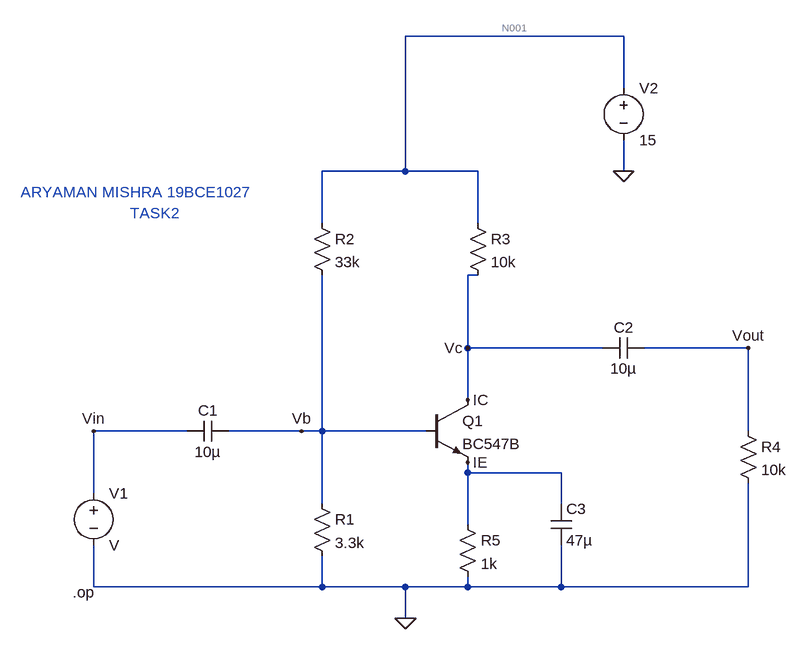
[diagram p0: schematic Draft1.asc]
Draft1.asc, the LTspice schematic file:
Version 4
SHEET 1 880 680
WIRE 128 -1088 -208 -1088
WIRE 128 -1008 128 -1088
WIRE -208 -880 -208 -1088
WIRE -208 -880 -336 -880
WIRE -96 -880 -208 -880
WIRE 128 -880 128 -928
WIRE -336 -800 -336 -880
WIRE -96 -800 -96 -880
WIRE -96 -720 -112 -720
WIRE -112 -608 -112 -720
WIRE 96 -608 -112 -608
WIRE 320 -608 160 -608
WIRE -112 -528 -112 -608
WIRE -544 -480 -688 -480
WIRE -368 -480 -480 -480
WIRE -336 -480 -336 -720
WIRE -336 -480 -368 -480
WIRE -176 -480 -336 -480
WIRE 320 -480 320 -608
WIRE -112 -416 -112 -432
WIRE 32 -416 -112 -416
WIRE -688 -384 -688 -480
WIRE -336 -368 -336 -480
WIRE 32 -368 32 -416
WIRE -112 -336 -112 -416
WIRE -688 -240 -688 -304
WIRE -336 -240 -336 -288
WIRE -336 -240 -688 -240
WIRE -208 -240 -336 -240
WIRE -112 -240 -112 -256
WIRE -112 -240 -208 -240
WIRE 32 -240 32 -304
WIRE 32 -240 -112 -240
WIRE 320 -240 320 -400
WIRE 320 -240 32 -240
WIRE -208 -192 -208 -240
FLAG -688 -480 Vin
FLAG -368 -480 Vb
FLAG 128 -880 0
FLAG 320 -608 Vout
FLAG -112 -608 Vc
FLAG -112 -528 IC
FLAG -112 -432 IE
FLAG -208 -192 0
DATAFLAG 528 -560 "V(ic)"
DATAFLAG 576 -512 "Ic(Q1)"
SYMBOL voltage -688 -400 R0
WINDOW 123 0 0 Left 0
WINDOW 39 0 0 Left 0
SYMATTR InstName V1
SYMBOL cap -480 -496 R90
WINDOW 0 0 32 VBottom 2
WINDOW 3 32 32 VTop 2
SYMATTR InstName C1
SYMATTR Value 10µ
SYMBOL res -352 -384 R0
SYMATTR InstName R1
SYMATTR Value 3.3k
SYMBOL res -352 -816 R0
SYMATTR InstName R2
SYMATTR Value 33k
SYMBOL res -112 -816 R0
SYMATTR InstName R3
SYMATTR Value 10k
SYMBOL npn -176 -528 R0
SYMATTR InstName Q1
SYMATTR Value BC547B
SYMBOL voltage 128 -1024 R0
WINDOW 123 0 0 Left 0
WINDOW 39 0 0 Left 0
SYMATTR InstName V2
SYMATTR Value 15
SYMBOL cap 160 -624 R90
WINDOW 0 0 32 VBottom 2
WINDOW 3 32 32 VTop 2
SYMATTR InstName C2
SYMATTR Value 10µ
SYMBOL res 304 -496 R0
SYMATTR InstName R4
SYMATTR Value 10k
SYMBOL res -128 -352 R0
SYMATTR InstName R5
SYMATTR Value 1k
SYMBOL cap 16 -368 R0
SYMATTR InstName C3
SYMATTR Value 47µ
TEXT -720 -232 Left 2 !.op
TEXT -800 -848 Left 2 ;ARYAMAN MISHRA 19BCE1027
TEXT -632 -816 Left 2 ;TASK2

The netlist it stands for:
* Draft1.asc
V1 Vin 0 V
C1 Vb Vin 10µ
R1 Vb 0 3.3k
R2 N001 Vb 33k
R3 N001 IC 10k
Q1 IC Vb IE 0 BC547B
V2 N001 0 15
C2 Vout IC 10µ
R4 Vout 0 10k
R5 IE 0 1k
C3 IE 0 47µ
.model NPN NPN
.model PNP PNP
.lib standard.bjt
.op
* ARYAMAN MISHRA 19BCE1027
* TASK2
.backanno
.end

* Results of the author's LTspice run, read from the files saved beside the schematic
* Operating Point:
*   V(vin) = 0 V
*   V(vb) = 1.357 V
*   V(n001) = 15 V
*   V(ic) = 7.735 V
*   V(ie) = 728.8 mV
*   V(vout) = 773.5 fV
*   Ic(Q1) = 726.5 µA
*   Ib(Q1) = 2.328 µA
*   Ie(Q1) = -728.8 µA
*   I(C3) = 0 A
*   I(C2) = 0 A
*   I(C1) = 0 A
*   I(R5) = 728.8 µA
*   I(R4) = 0 A
*   I(R3) = 726.5 µA
*   I(R2) = 413.4 µA
*   I(R1) = 411.1 µA
*   I(V2) = -1.14 mA
*   I(V1) = 0 A
* From the log:
*   Semiconductor Device Operating Points:
*                           --- Bipolar Transistors ---
*   Name:       q1
*   Model:    bc547b
*   Ib:       2.33e-06
*   Ic:       7.26e-04
*   Vbe:      6.28e-01
*   Vbc:     -6.38e+00
*   Vce:      7.01e+00
*   BetaDC:   3.12e+02
*   Gm:       2.77e-02
*   Rpi:      1.12e+04
*   Rx:       1.00e+00
*   Ro:       9.37e+04
*   Cbe:      5.28e-11
*   Cbc:      1.00e-12
*   Cjs:      0.00e+00
*   BetaAC:   3.11e+02
*   Cbx:      6.15e-13
*   Ft:       8.10e+07